# Altium schematic sheet STM32.SchDoc
size A; SheetNumber: 2; SheetTotal: 7
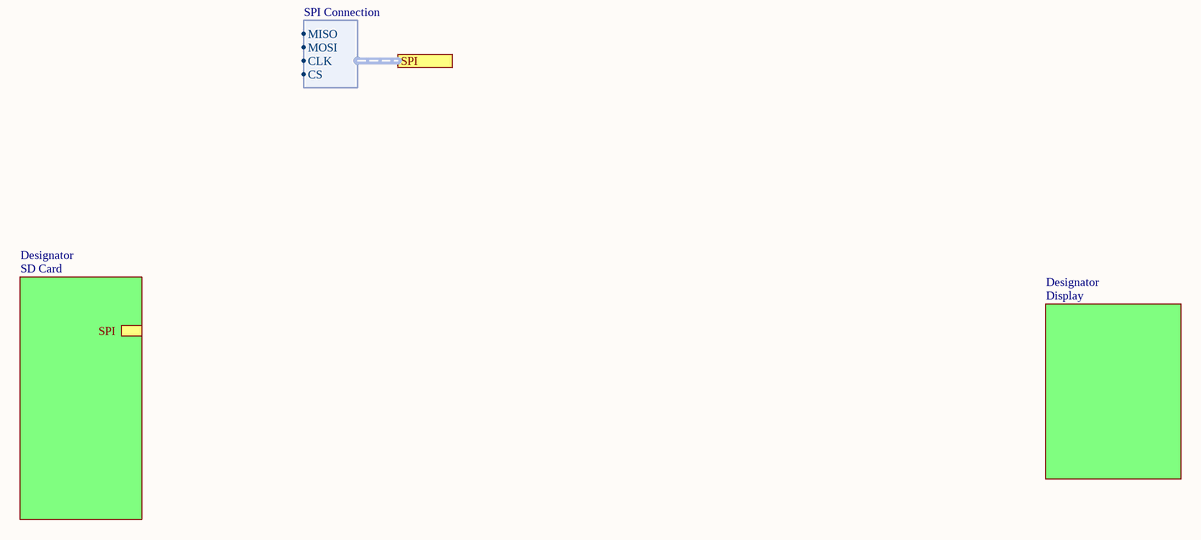
[diagram p0: STM32.SchDoc]

## Sub-sheets
Designator = Display: no entries
Designator = SD Card: SPI (harness SPI Connection)

## Ports
SPI (harness SPI Connection)

## Harnesses
SPI Connection: MISO, MOSI, CLK, CS